# Altium schematic sheet PAGE2-SFP_CONNECTORS.SchDoc
size A3; DocumentNumber: 2; SheetNumber: 2; SheetTotal: 3
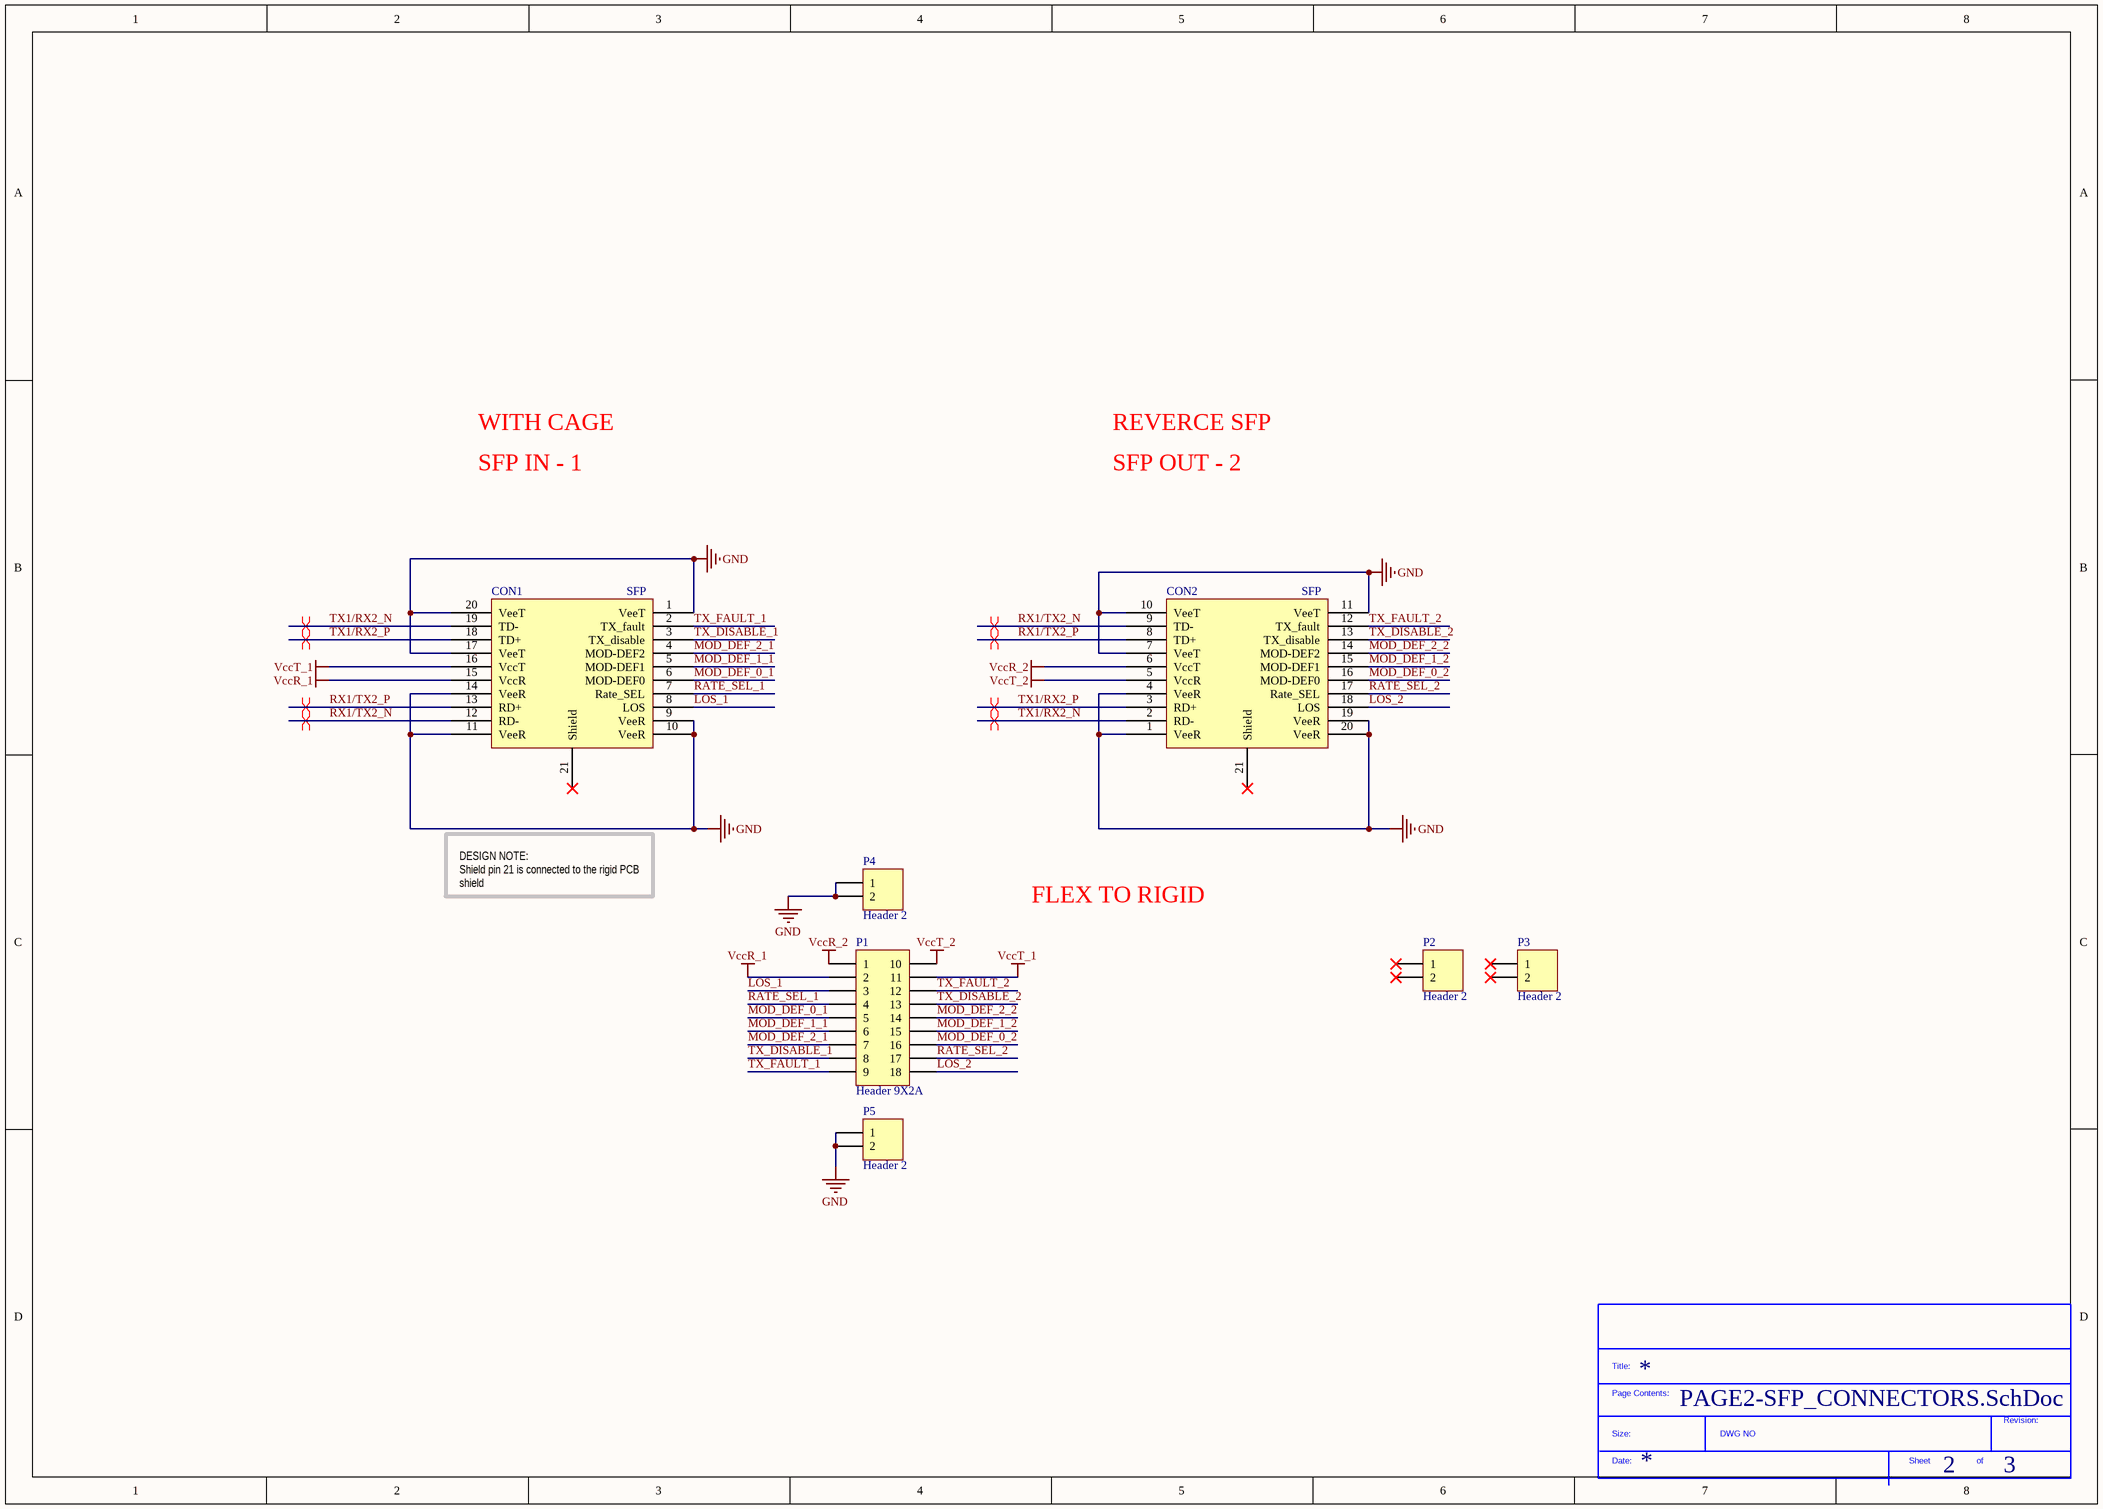
[diagram p0: PAGE2-SFP_CONNECTORS.SchDoc]

## Parts
*?  SDTitleBlock  (value not drawn)  (graphical)
CON1  SFP  [PCB_SFP_COVER]
CON2  SFP  [SFP]
P1  Header 9X2A  [HDR2X9_CEN]  (no BOM)
P2  Header 2  [HDR1X2]  (no BOM)
P3  Header 2  [HDR1X2]  (no BOM)
P4  Header 2  [HDR1X2]  (no BOM)
P5  Header 2  [HDR1X2]  (no BOM)

## Nets
GND: CON1.1(VeeT) CON1.9(VeeR) CON1.10(VeeR) CON1.11(VeeR) CON1.14(VeeR) CON1.17(VeeT) CON1.20(VeeT) CON2.1(VeeR) CON2.4(VeeR) CON2.7(VeeT) CON2.10(VeeT) CON2.11(VeeT) CON2.19(VeeR) CON2.20(VeeR) P4.1 P4.2 P5.1 P5.2
VccR_1: CON1.15(VccR) P1.2
VccR_2: CON2.6(VccT) P1.1
VccT_1: CON1.16(VccT) P1.11
VccT_2: CON2.5(VccR) P1.10
LOS_1: CON1.8(LOS) P1.3
LOS_2: CON2.18(LOS) P1.18
MOD_DEF_0_1: CON1.6(MOD-DEF0) P1.5
MOD_DEF_0_2: CON2.16(MOD-DEF0) P1.16
MOD_DEF_1_1: CON1.5(MOD-DEF1) P1.6
MOD_DEF_1_2: CON2.15(MOD-DEF1) P1.15
MOD_DEF_2_1: CON1.4(MOD-DEF2) P1.7
MOD_DEF_2_2: CON2.14(MOD-DEF2) P1.14
RATE_SEL_1: CON1.7(Rate_SEL) P1.4
RATE_SEL_2: CON2.17(Rate_SEL) P1.17
RX1/TX2_N: CON1.12(RD-) CON2.9(TD-)
RX1/TX2_P: CON1.13(RD+) CON2.8(TD+)
TX1/RX2_N: CON1.19(TD-) CON2.2(RD-)
TX1/RX2_P: CON1.18(TD+) CON2.3(RD+)
TX_DISABLE_1: CON1.3(TX_disable) P1.8
TX_DISABLE_2: CON2.13(TX_disable) P1.13
TX_FAULT_1: CON1.2(TX_fault) P1.9
TX_FAULT_2: CON2.12(TX_fault) P1.12

Not connected (* = marked no-connect by the designer): CON1 21(Shield)*; CON2 21(Shield)*; P2 1* 2*; P3 1* 2*

## Layout directives
differential pair: RX1/TX2_N, RX1/TX2_P, TX1/RX2_N, TX1/RX2_P

## Notes on the sheet
- WITH CAGE
- REVERCE SFP
- SFP IN - 1
- SFP OUT - 2
- DESIGN NOTE:
  Shield pin 21 is connected to the rigid PCB shield
- FLEX TO RIGID
- (in symbol SDTitleBlock) Title:; Page Contents:; Revision:; Size:; DWG NO; Date:; Sheet; of

## Library data of the parts
CON1 = SFP connector: SFP with cage; Manufacturer Part Numbe: 1367073-1; Implementation: YES; Manifacturer: AMP - TE CONNECTIVITY; Datasheet: *; Value: SFP; Supplier 1: Farnell; Supplier Part Number 1: 1629987; Category: Connector
CON2 = SFP connector reverse: SFP, woutout cage, reverse orientation of SFP module; Manufacturer Part Number: 1367073-1; Implementation: YES; Manifacturer: AMP - TE CONNECTIVITY; Supplier 1: Farnell; Supplier Part Number 1: 1629987; Datasheet: *; Value: SFP; Category: Connector
P1 = Header 9X2A: Header, 9-Pin, Dual row; LatestRevisionDate: 17-Jul-2002; LatestRevisionNote: Re-released for DXP Platform.; Publisher: Altium Limited
P2-P5 = Header 2: Header, 2-Pin; LatestRevisionDate: 17-Jul-2002; LatestRevisionNote: Re-released for DXP Platform.; Publisher: Altium Limited